# EAGLE schematic mother (EAGLE 4.13)
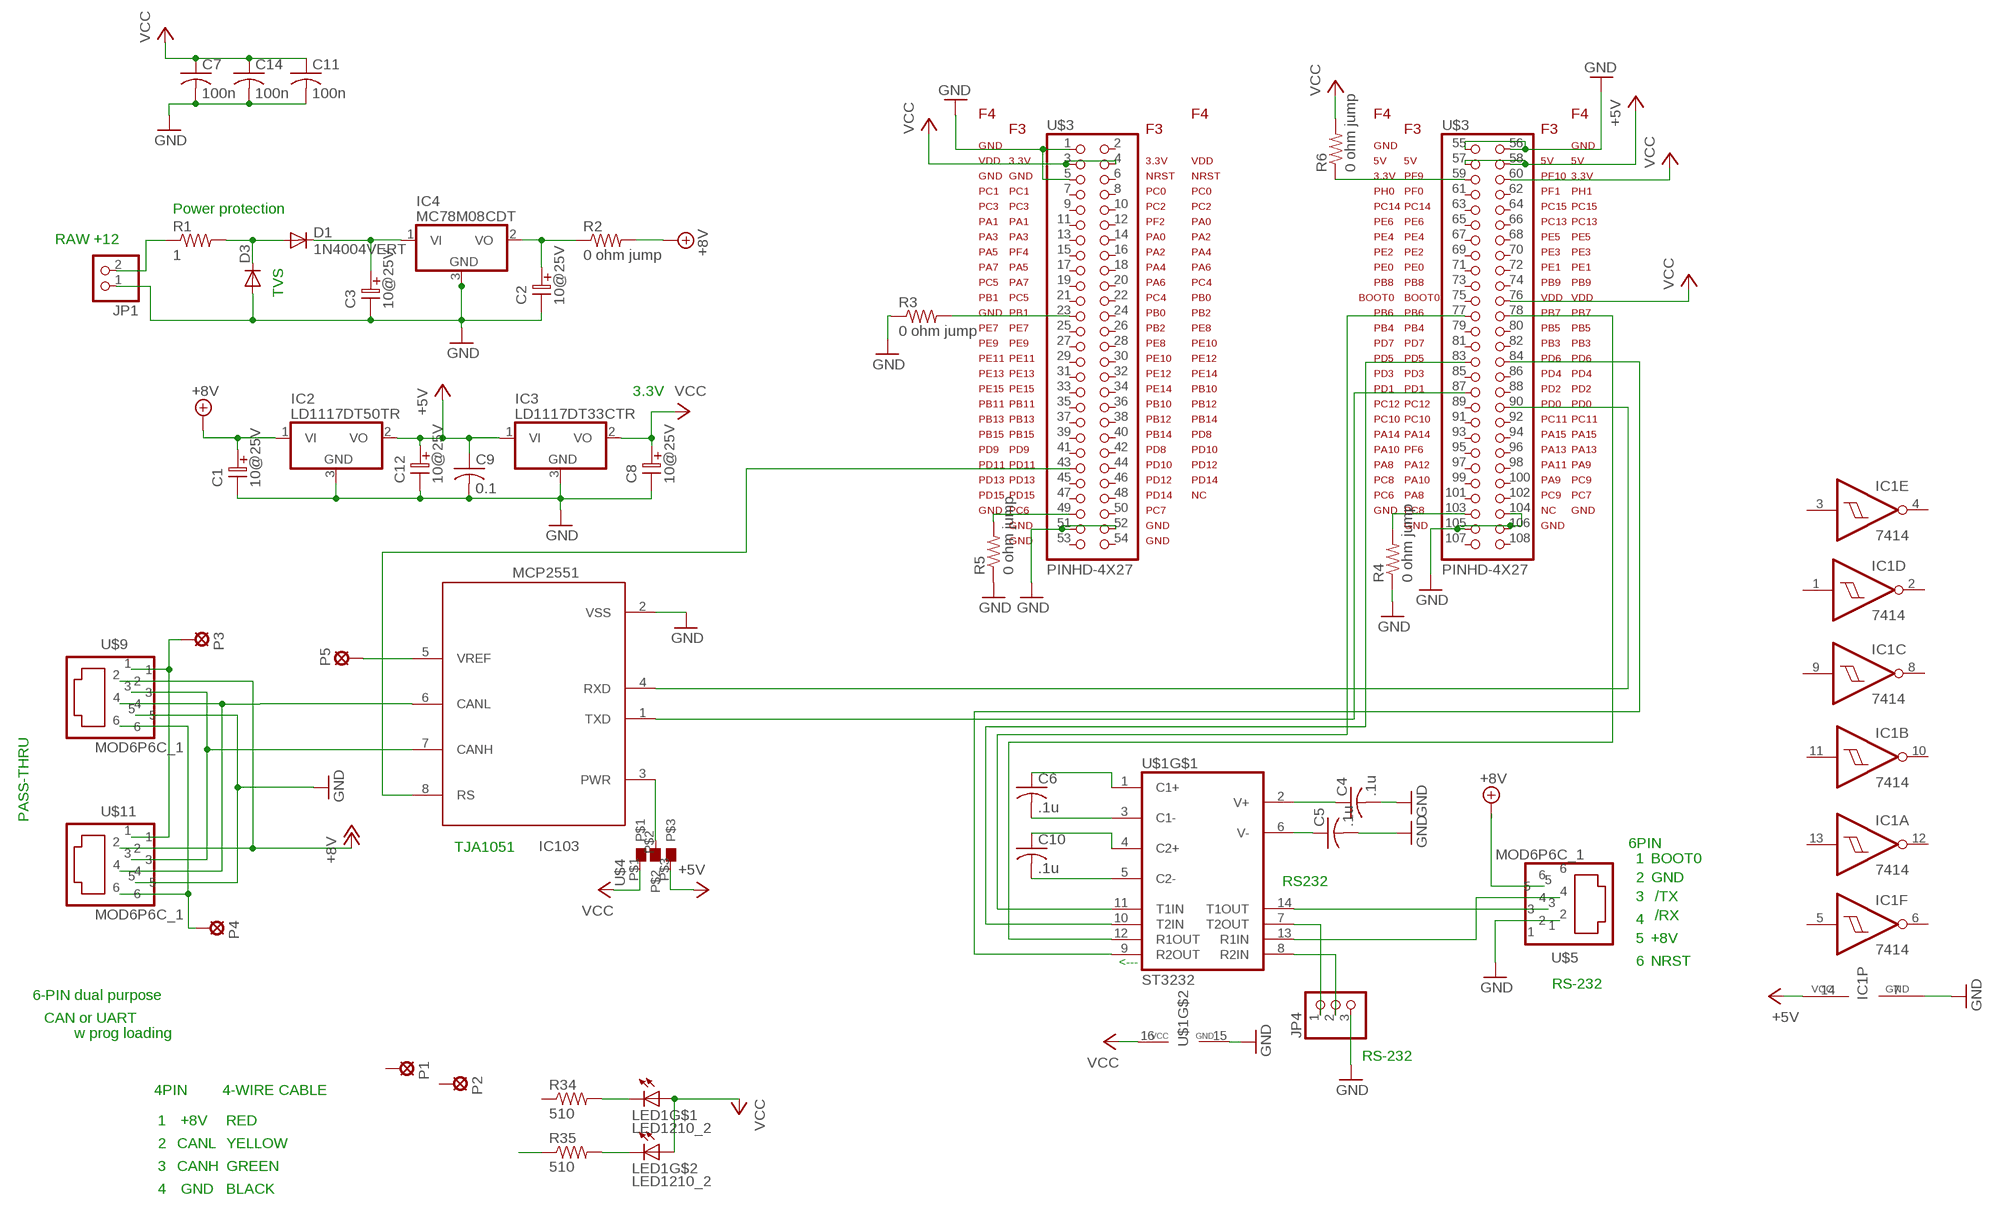
[diagram p0: schematic, sheet 1]

## Parts
C1  10@25V  ELC-2,5L  [ES-2,5L]
C2  10@25V  ELC-2,5L  [ES-2,5L]
C3  10@25V  ELC-2,5L  [ES-2,5L]
C4  .1u  C-USC0805  [C0805]
C5  .1u  C-USC0805  [C0805]
C6  .1u  C-USC0805  [C0805]
C7  100n  C-USC0603  [C0603]
C8  10@25V  ELC-2,5L  [ES-2,5L]
C9  0.1  C-USC0603  [C0603]
C10  .1u  C-USC0805  [C0805]
C11  100n  C-USC0603  [C0603]
C12  10@25V  ELC-2,5L  [ES-2,5L]
C14  100n  C-USC0603  [C0603]
D1  1N4004VERT  [DO41-VERT]
D3  DIODE-DO214BA  [DO-214BA]
IC1  7414  [TSSOP14]
IC2  LD1117DT50TR  7805DT  [TO252]
IC3  LD1117DT33CTR  7805DT  [TO252]
IC4  MC78M08CDT  7805DT  [TO252]
IC103  MCP2551  [SO-08]
JP1  PINHD-1X2  [1X02]
JP4  PINHD-1X3  [1X03]
LED1  LED1210_2  [CHIP2LED_1210]
P1  PE14  SOLDPAD028  [SOLPAD028]
P2  PE14  SOLDPAD028  [SOLPAD028]
P3  PE14  SOLDPAD028  [SOLPAD028]
P4  PE14  SOLDPAD028  [SOLPAD028]
P5  PE14  SOLDPAD028  [SOLPAD028]
R1  1  R-US_0207/2V  [0207/2V]
R2  0 ohm jump  R-US_R0603  [R0603]
R3  0 ohm jump  R-US_R0603  [R0603]
R4  0 ohm jump  R-US_R0603  [R0603]
R5  0 ohm jump  R-US_R0603  [R0603]
R6  0 ohm jump  R-US_R0603  [R0603]
R34  510  R-US_R0603  [R0603]
R35  510  R-US_R0603  [R0603]
U$1  ST3232  [SO16]
U$3  PINHD-4X27  [4X27]
U$4  SMD-3  [SMD_3]
U$5  MOD6P6C_1  [MOD6P6C_1]
U$9  MOD6P6C_1  [MOD6P6C_1]
U$11  MOD6P6C_1  [MOD6P6C_1]

## Nets
+5V: C9.1 C12.1 IC1.14(P:VCC) IC2.2(VO) IC3.1(VI) U$3.57 U$3.58 U$4.P$3
+8V: C1.1 IC2.1(VI) R2.2 U$5.5
+12V: U$9.2 U$11.2 ; supply symbol labelled +8V
C1+: C6.1 U$1.1(C1+)
C1-: C6.2 U$1.3(C1-)
C2+: C10.1 U$1.4(C2+)
C2-: C10.2 U$1.5(C2-)
CANH: IC103.7(CANH) U$9.3 U$11.3
CANL: IC103.6(CANL) U$9.4 U$11.4
GND: C1.2 C2.2 C3.2 C4.2 C5.2 C7.2 C8.2 C11.2 C12.2 C14.2 D3.A IC1.7(P:GND) IC2.3(GND) IC3.3(GND) IC4.3(GND) IC103.2(VSS) JP1.1 JP4.3 R3.1 R4.1 R5.1 U$1.15(GND) U$3.1 U$3.5 U$3.51 U$3.52 U$3.55 U$3.56 U$3.104 U$3.105 U$3.106 U$5.2 U$9.5 U$11.5
N$1: P3.MP U$9.1 U$11.1
N$2: P4.MP U$9.6 U$11.6
N$7: R6.1 U$3.59
N$8: IC103.3(PWR) U$4.P$2
N$9: D1.A D3.C R1.2
N$10: C3.1 D1.C IC4.1(VI)
N$12: JP1.2 R1.1
N$13: IC103.5(VREF) P5.MP
N$14: C2.1 IC4.2(VO) R2.1
N$15: R4.2 U$3.103
N$16: R5.2 U$3.49
N$19: R3.2 U$3.23
PB6_USART1_TX: U$1.11(T1IN) U$3.77
PB7_USART1_RX: U$1.12(R1OUT) U$3.78
PB8_CAN1_RX: IC103.4(RXD) U$3.90
PB9_CAN1_TX: IC103.1(TXD) U$3.87
PB12_LED1: LED1.C R34.2
PB13_LED: R35.1
PB13_LED2: LED1.C1(C) R35.2
PD5_USART2_TX: U$1.10(T2IN) U$3.83
PD6_USART2_RX: U$1.9(R2OUT) U$3.84
PD11_CAN_RS: IC103.8(RS) U$3.43
RS232_R1IN_USART1_RX: U$1.13(R1IN) U$5.4
T1OUT_USART1_TX: U$1.14(T1OUT) U$5.3
T2OUT_UART_TX: JP4.1 U$1.7(T2OUT)
VCC: C7.1 C8.1 C11.1 C14.1 IC3.2(VO) LED1.A LED1.A1(A) R6.2 U$1.16(VCC) U$3.3 U$3.4 U$3.60 U$3.76 U$4.P$1
VRS232+: C4.1 U$1.2(V+)
VRS232-: C5.1 U$1.6(V-)
|RS232_R2IN_UART_RX: JP4.2 U$1.8(R2IN)
Unconnected: C9.2 IC1.1(D:I) IC1.2(D:O) IC1.3(E:I) IC1.4(E:O) IC1.5(F:I) IC1.6(F:O) IC1.8(C:O) IC1.9(C:I) IC1.10(B:O) IC1.11(B:I) IC1.12(A:O) IC1.13(A:I) P1.MP P2.MP R34.1 U$3.2 U$3.6 U$3.7 U$3.8 U$3.9 U$3.10 U$3.11 U$3.12 U$3.13 U$3.14 U$3.15 U$3.16 U$3.17 U$3.18 U$3.19 U$3.20 U$3.21 U$3.22 U$3.24 U$3.25 U$3.26 U$3.27 U$3.28 U$3.29 U$3.30 U$3.31 U$3.32 U$3.33 U$3.34 U$3.35 U$3.36 U$3.37 U$3.38 U$3.39 U$3.40 U$3.41 U$3.42 U$3.44 U$3.45 U$3.46 U$3.47 U$3.48 U$3.50 U$3.53 U$3.54 U$3.61 U$3.62 U$3.63 U$3.64 U$3.65 U$3.66 U$3.67 U$3.68 U$3.69 U$3.70 U$3.71 U$3.72 U$3.73 U$3.74 U$3.75 U$3.79 U$3.80 U$3.81 U$3.82 U$3.85 U$3.86 U$3.88 U$3.89 U$3.91 U$3.92 U$3.93 U$3.94 U$3.95 U$3.96 U$3.97 U$3.98 U$3.99 U$3.100 U$3.101 U$3.102 U$3.107 U$3.108 U$5.1 U$5.6

## Notes on the sheet
- Power protection
- RAW +12
- TVS
- 3.3V
- PASS-THRU
- TJA1051 | 6PIN
- 1 | BOOT0
- RS232 | 2 | GND
- 3 | /TX
- 4 | /RX
- 5 | +8V
- <--- | 6 | NRST
- RS-232
- 6-PIN dual purpose
- CAN or UART
- w prog loading
- RS-232
- 4PIN | 4-WIRE CABLE
- 1 | +8V | RED
- 2 | CANL | YELLOW
- 3 | CANH | GREEN
- 4 | GND | BLACK

## Library data of the parts
C1-C3 C8 C12 = DEH:ELC-2,5L
C4-C7 C9-C11 C14 = rcl:C-US: CAPACITOR, American symbol
D1 = diode-1:1N4004: DIODE general purpose rectifier, 1 A
D3 = diode-1:DIODE-: DIODE
IC1 = 74xx-us:74*14: Hex schmitt trigger INVERTER
IC2-IC4 = linear:78*: Positive VOLTAGE REGULATOR
IC103 = texas:MCP2551
JP1 = pinhead:PINHD-1X2: PIN HEADER
JP4 = pinhead:PINHD-1X3: PIN HEADER
LED1 = led:LED1210_2
P1-P5 = solpad:SOLDPAD028
R1-R6 R34 R35 = rcl:R-US_: RESISTOR, American symbol
U$1 = maxim:ST3232
U$3 = pinhead:PINHD-4X27
U$4 = solpad:SMD-3
U$5 U$9 U$11 = DEH:MOD6P6C_1